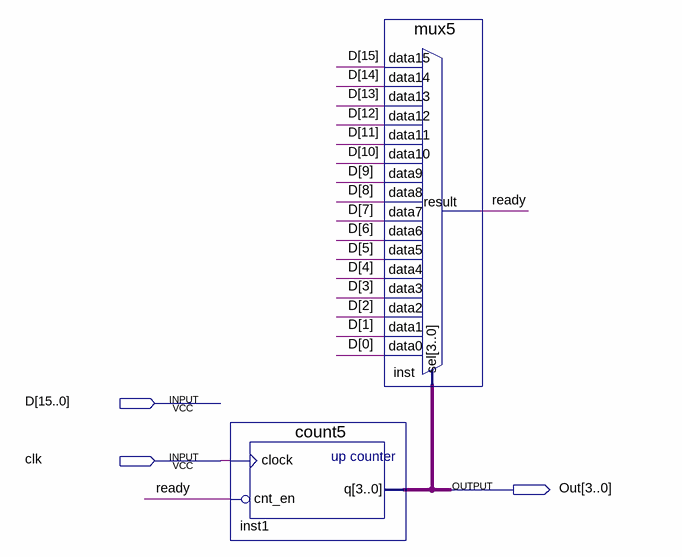
[diagram p0: schematic sheet]
// Quartus schematic b5.bdf as structural Verilog: 2 symbols, 3 pins
module b5 (
  input  [15:0] D,
  input  clk,
  output [3:0] Out
);

  wire ready;

  count5 inst1 (.clock(clk), .cnt_en(~ready), .q(Out));
  mux5 inst (
    .data15(D[15]), .data14(D[14]), .data13(D[13]), .data12(D[12]), .data11(D[11]), .data10(D[10]),
    .data9(D[9]), .data8(D[8]), .data7(D[7]), .data6(D[6]), .data5(D[5]), .data4(D[4]), .data3(D[3]),
    .data2(D[2]), .data1(D[1]), .data0(D[0]), .sel(Out), .result(ready));
endmodule
